# Altium schematic sheet Antenna Supervisory Circuit.SchDoc
size A; SheetNumber: 4; SheetTotal: 6
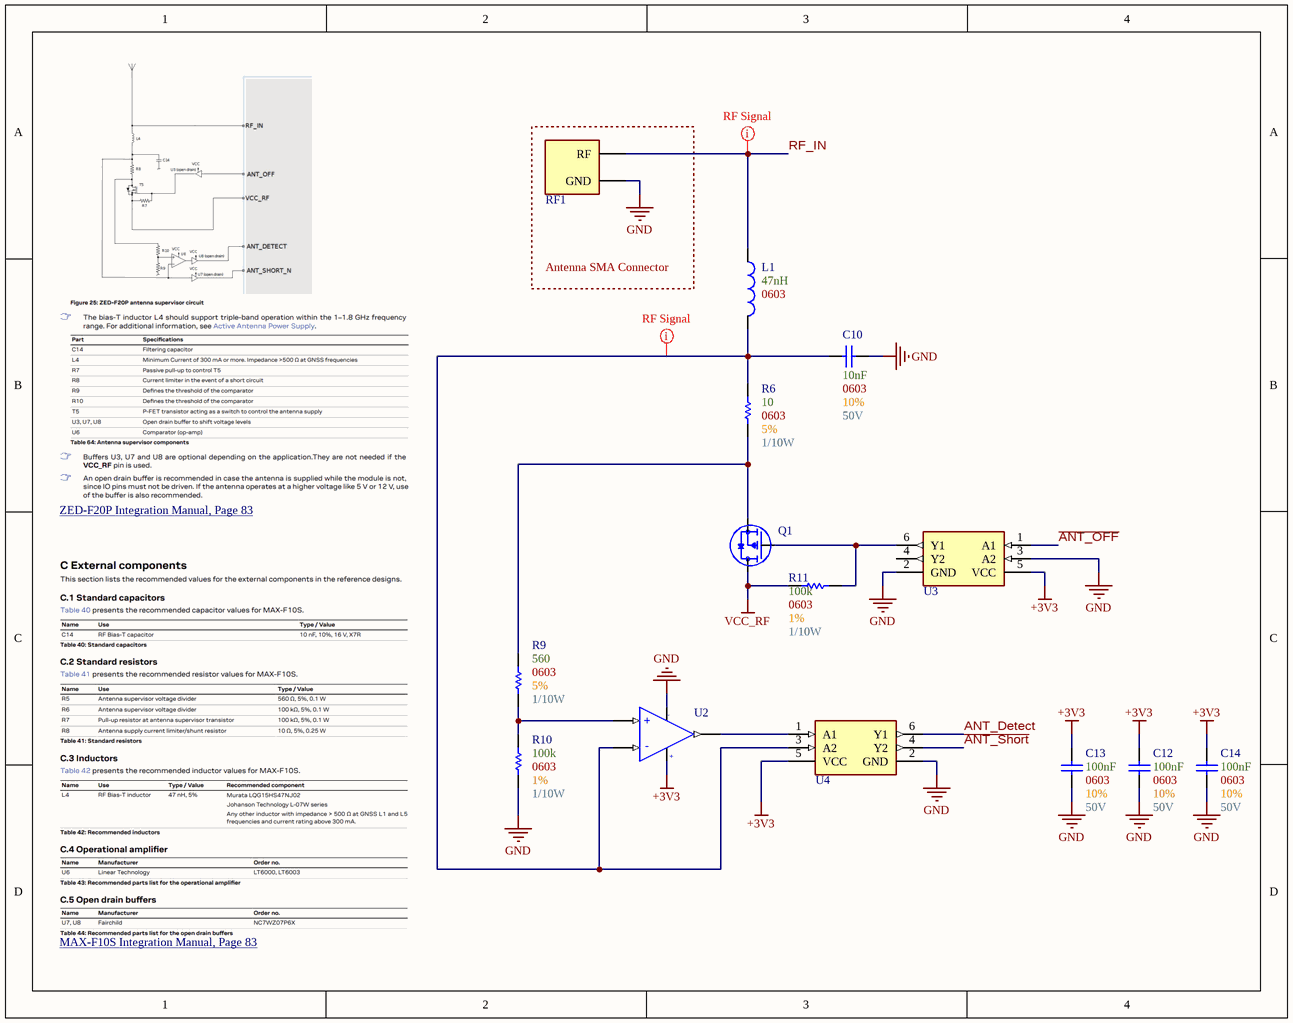
[diagram p0: Antenna Supervisory Circuit.SchDoc]

## Parts
C10  Max Voltage: 50V  Size Package: 0603  Tolerance: 10%  Capacitance: 10nF  [[Cap] SMD 0603]  (hidden comment: [Cap] 0603 0.01uF 10% 50V)
C12  Max Voltage: 50V  Size Package: 0603  Tolerance: 10%  Capacitance: 100nF  [[Cap] SMD 0603]  (hidden comment: [Cap] 0603 0.1uF 10% 50V)
C13  Max Voltage: 50V  Size Package: 0603  Tolerance: 10%  Capacitance: 100nF  [[Cap] SMD 0603]  (hidden comment: [Cap] 0603 0.1uF 10% 50V)
C14  Max Voltage: 50V  Size Package: 0603  Tolerance: 10%  Capacitance: 100nF  [[Cap] SMD 0603]  (hidden comment: [Cap] 0603 0.1uF 10% 50V)
L1  Package: 0603  Inductance: 47nH  [[Inductor] SMD 0603]  (hidden comment: [47nH] SMD 0603 90mA)
Q1  [PMOS] SMD 20V 1A 200mOhm  [SOT323]  (value not drawn)
R6  Wattage: 1/10W  Tolerance: 5%  Resistance: 10  Size Package: 0603  [[Res] SMD 0603]  (hidden comment: [10] SMD 0603 5% 1/10W)
R9  Wattage: 1/10W  Tolerance: 5%  Resistance: 560  Size Package: 0603  [[Res] SMD 0603]  (hidden comment: [560] SMD 0603 5% 1/10W)
R10  Wattage: 1/10W  Tolerance: 1%  Resistance: 100k  Size Package: 0603  [[Res] SMD 0603]  (hidden comment: [100k] SMD 0603 1% 1/10W)
R11  Wattage: 1/10W  Tolerance: 1%  Resistance: 100k  Size Package: 0603  [[Res] SMD 0603]  (hidden comment: [100k] SMD 0603 1% 1/10W)
RF1  [SMA] 90deg Thru-Hole  [[SMA] 90deg Thru-Hole]  (value not drawn)
U2  [Op-Amp] Rail-to-Rail Vmax=16V GBP=3kHz  [[Op-Amp] Rail-to-Rail Vmax=16V GBP=3kHz]  (value not drawn)
U3  [Buffer] Dual Open Drain  [[Buffer] Dual Open Drain]  (value not drawn)
U4  [Buffer] Dual Open Drain  [[Buffer] Dual Open Drain]  (value not drawn)

## Blocks framed on the sheet
Antenna SMA Connector: RF1

## Nets
+3V3: C12.2 C13.2 C14.2 U2.5(V+) U3.5(VCC) U4.5(VCC)
GND: C10.1 C12.1 C13.1 C14.1 R10.1 RF1.2(GND) U2.2(V-) U3.2(GND) U3.3(A2) U4.2(GND)
VCC_RF: Q1.2(Source) R11.2
~{ANT_OFF}: U3.1(A1)
~{ANT_Short}: U4.4(Y2)
ANT_Detect: U4.6(Y1)
RF_IN: L1.1 RF1.1(RF)
NetC10_2: C10.2 L1.2 R6.2 U2.4(-IN) U4.3(A2)
NetQ1_1: Q1.1(Gate) R11.1 U3.6(Y1)
NetQ1_3: Q1.3(Drain) R6.1 R9.2
NetR9_1: R9.1 R10.2 U2.3(+IN)
NetU2_1: U2.1(OUT) U4.1(A1)

Not connected (* = marked no-connect by the designer): U3 4(Y2)

## Layout directives
net class nRF Signal: NetC10_2, RF_IN

## Notes on the sheet
- ZED-F20P Integration Manual, Page 83 <https://content.u-blox.com/sites/default/files/documents/ZED-F20P_IntegrationManual_UBXDOC-304424225-19671.pdf#page=83>
- MAX-F10S Integration Manual, Page 83 <https://content.u-blox.com/sites/default/files/documents/MAX-F10S_IntegrationManual_UBXDOC-963802114-12892.pdf#page=83>
- (in symbol [Op-Amp] Rail-to-Rail Vmax=16V GBP=3kHz) -; +

## Library data of the parts
C10 = [Cap] 0603 0.01uF 10% 50V: C0603C103K5RACTU; Supplier 1: DigiKey; Supplier Part Number 1: 399-C0603C103K5RACTUDKR-ND
C12-C14 = [Cap] 0603 0.1uF 10% 50V: CL10B104KB8NNNC; Supplier 1: DigiKey; Supplier Part Number 1: 1276-1000-6-ND
L1 = [47nH] SMD 0603 90mA: AIMC-0603-47NJ-T; Supplier 1: DigiKey; Supplier Part Number 1: 535-11541-6-ND
Q1 = [PMOS] SMD 20V 1A 200mOhm: PMF170XP,115; Supplier 1: DigiKey; Supplier Part Number 1: 1727-1229-6-ND
R6 = [10] SMD 0603 5% 1/10W: RC0603JR-1310RL; Supplier 1: DigiKey; Supplier Part Number 1: 13-RC0603JR-1310RLDKR-ND
R9 = [560] SMD 0603 5% 1/10W: RC0603JR-07560RL; Supplier 1: DigiKey; Supplier Part Number 1: 311-560GRDKR-ND
R10 R11 = [100k] SMD 0603 1% 1/10W: RC0603FR-07100KL; Supplier 1: DigiKey; Supplier Part Number 1: 311-100KHRDKR-ND
RF1 = [SMA] 90deg Thru-Hole: RFPC-SMA27-F; Supplier 1: DigiKey; Supplier Part Number 1: 2073-RFPC-SMA27-F-ND
U2 = [Op-Amp] Rail-to-Rail Vmax=16V GBP=3kHz: LT6003CS5#TRMPBF; Supplier 1: DigiKey; Supplier Part Number 1: 505-LT6003CS5#TRMPBFCT-ND
U3 U4 = [Buffer] Dual Open Drain: NC7WZ07P6X; Supplier 1: DigiKey; Supplier Part Number 1: NC7WZ07P6XDKR-ND